# EAGLE schematic ldd-boardv42 (EAGLE 8.2.1)
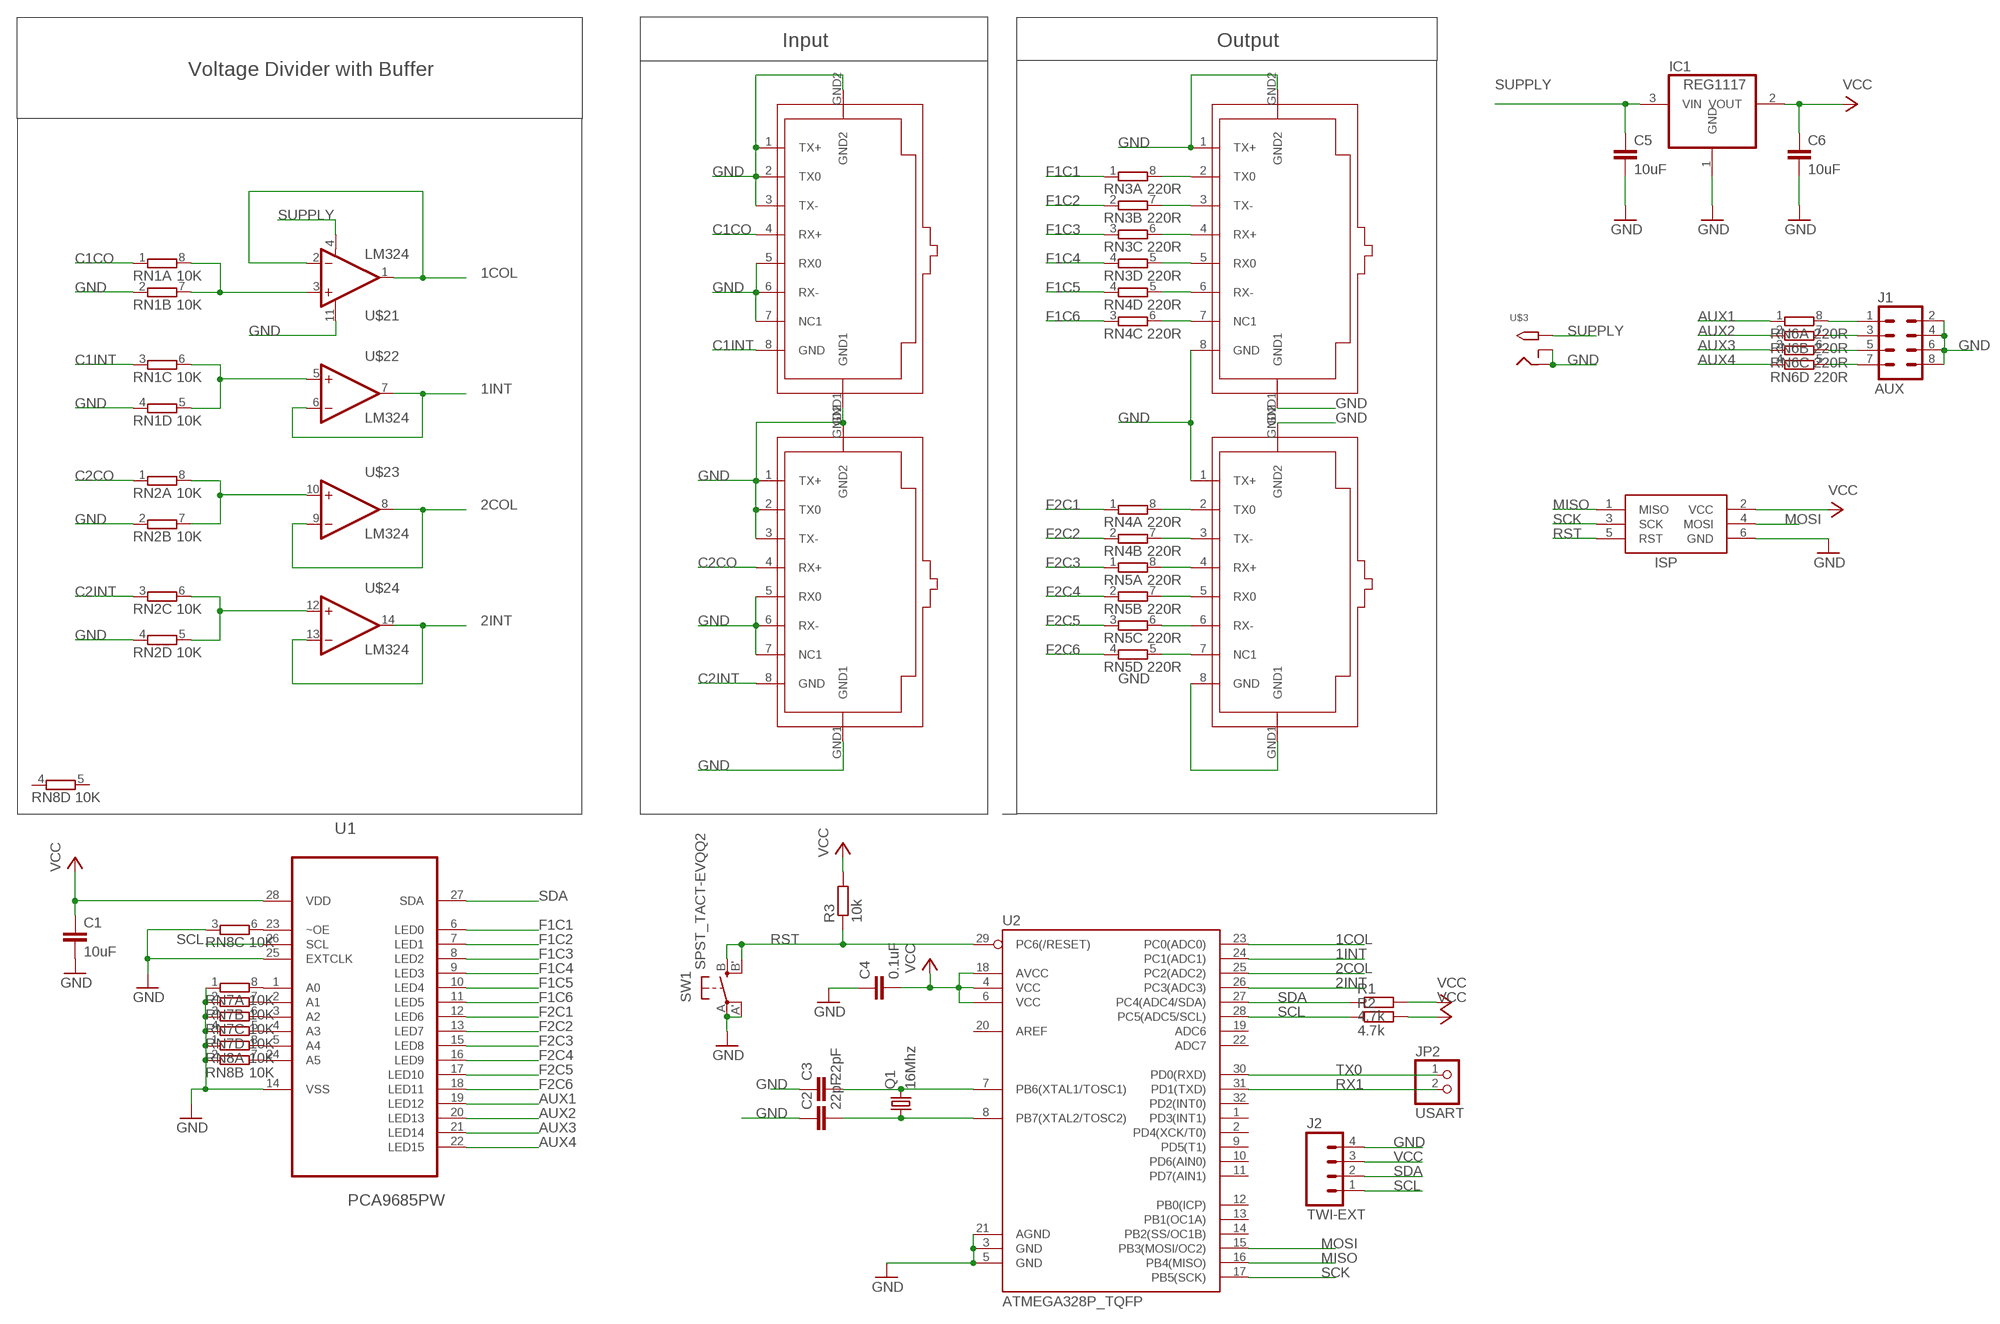
[diagram p0: schematic, sheet 1]

## Parts
C1  10uF  C-EUC0805K  [C0805K]
C2  22pF  C-EUC0805K  [C0805K]
C3  22pF  C-EUC0805K  [C0805K]
C4  0.1uF  C-EUC0805K  [C0805K]
C5  10uF  C-EUC0805K  [C0805K]
C6  10uF  C-EUC0805K  [C0805K]
IC1  REG1117  [SOT223]
ISP  AVRISP-6  [AVRISP]
J1  AUX  M04X2  [2X4]
J2  TWI-EXT  M04PTH  [1X04]
JP2  USART  PINHD-1X2  [1X02]
Q1  16Mhz  CRYSTALHC49UP  [HC49UP]
R1  4.7k  R-EU_R0805  [R0805]
R2  4.7k  R-EU_R0805  [R0805]
R3  10k  R-EU_R0805  [R0805]
RN1  10K  4R-NEXBV8V  [EXBV8V]
RN2  10K  4R-NEXBV8V  [EXBV8V]
RN3  220R  4R-NEXBV8V  [EXBV8V]
RN4  220R  4R-NEXBV8V  [EXBV8V]
RN5  220R  4R-NEXBV8V  [EXBV8V]
RN6  220R  4R-NEXBV8V  [EXBV8V]
RN7  10K  4R-NEXB38V  [EXB38V]
RN8  10K  4R-NEXB38V  [EXB38V]
SW1  SPST_TACT-EVQQ2  [EVQ-Q2]
U1  PCA9685PW  [SOP65P640X110-28N]
U2  ATMEGA328P_TQFP  [TQFP32-08]
U$1  RJ45-TRAFO  [RJ45-TRAFO]
U$2  LM324  [SOIC-14]
U$3  2.1MMJACKTHM  [PJ-102A]
U$4  RJ45-TRAFO  [RJ45-TRAFO]
U$5  RJ45-TRAFO  [RJ45-TRAFO]
U$6  RJ45-TRAFO  [RJ45-TRAFO]

## Nets
1COL: U2.23(PC0(ADC0)) U$2.1(1:OUT) U$2.2(1:-IN)
1INT: U2.24(PC1(ADC1)) U$2.6(2:-IN) U$2.7(2:OUT)
2COL: U2.25(PC2(ADC2)) U$2.8(3:OUT) U$2.9(3:-IN)
2INT: U2.26(PC3(ADC3)) U$2.13(4:-IN) U$2.14(4:OUT)
AUX1: RN6.1 U1.19(LED12)
AUX2: RN6.2 U1.20(LED13)
AUX3: RN6.3 U1.21(LED14)
AUX4: RN6.4 U1.22(LED15)
C1CO: RN1.1 U$6.4(RX+)
C1INT: RN1.3 U$6.8(GND)
C2CO: RN2.1 U$5.4(RX+)
C2INT: RN2.3 U$5.8(GND)
F1C1: RN3.1 U1.6(LED0)
F1C2: RN3.2 U1.7(LED1)
F1C3: RN3.3 U1.8(LED2)
F1C4: RN3.4 U1.9(LED3)
F1C5: RN4.4 U1.10(LED4)
F1C6: RN4.3 U1.11(LED5)
F2C1: RN4.1 U1.12(LED6)
F2C2: RN4.2 U1.13(LED7)
F2C3: RN5.1 U1.15(LED8)
F2C4: RN5.2 U1.16(LED9)
F2C5: RN5.3 U1.17(LED10)
F2C6: RN5.4 U1.18(LED11)
GND [Supply]: C1.2 C2.1 C3.1 C4.1 C5.2 C6.2 IC1.1(GND) ISP.6(GND) J1.2 J1.4 J1.6 J1.8 J2.4 RN1.2 RN1.4 RN2.2 RN2.4 RN7.1 RN7.2 RN7.3 RN7.4 RN8.1 RN8.2 RN8.3 SW1.A'(P1) SW1.A(P) U1.14(VSS) U1.25(EXTCLK) U2.3(GND) U2.5(GND) U2.21(AGND) U$1.1(TX+) U$1.8(GND) U$1.GND1 U$1.GND2 U$2.11(1:V-) U$3.RING U$3.RING_SW U$4.1(TX+) U$4.8(GND) U$4.GND1 U$4.GND2 U$5.1(TX+) U$5.2(TX0) U$5.3(TX-) U$5.5(RX0) U$5.6(RX-) U$5.7(NC1) U$5.GND1 U$5.GND2 U$6.1(TX+) U$6.2(TX0) U$6.3(TX-) U$6.5(RX0) U$6.6(RX-) U$6.7(NC1) U$6.GND1 U$6.GND2
MISO: ISP.1(MISO) U2.16(PB4(MISO))
MOSI: ISP.4(MOSI) U2.15(PB3(MOSI/OC2))
N$1: RN1.7 RN1.8 U$2.3(1:+IN)
N$2: RN1.5 RN1.6 U$2.5(2:+IN)
N$3: J1.1 RN6.8
N$4: RN4.6 U$4.7(NC1)
N$5: RN2.7 RN2.8 U$2.10(3:+IN)
N$6: RN4.5 U$4.6(RX-)
N$7: RN3.5 U$4.5(RX0)
N$8: RN2.5 RN2.6 U$2.12(4:+IN)
N$9: RN3.6 U$4.4(RX+)
N$10: RN3.7 U$4.3(TX-)
N$11: RN3.8 U$4.2(TX0)
N$12: J1.3 RN6.7
N$13: J1.5 RN6.6
N$14: J1.7 RN6.5
N$15: RN7.8 U1.1(A0)
N$16: RN7.7 U1.2(A1)
N$17: RN7.6 U1.3(A2)
N$18: RN7.5 U1.4(A3)
N$19: RN8.8 U1.5(A4)
N$20: RN4.7 U$1.3(TX-)
N$21: RN4.8 U$1.2(TX0)
N$22: RN5.8 U$1.4(RX+)
N$23: RN5.7 U$1.5(RX0)
N$24: RN5.6 U$1.6(RX-)
N$25: RN5.5 U$1.7(NC1)
N$26: RN8.7 U1.24(A5)
N$27: C3.2 Q1.2 U2.7(PB6(XTAL1/TOSC1))
N$28: RN8.6 U1.23(~OE)
N$29: C2.2 Q1.1 U2.8(PB7(XTAL2/TOSC2))
RST: ISP.5(RST) R3.1 SW1.B'(S1) SW1.B(S) U2.29(PC6(/RESET))
RX1: JP2.2 U2.31(PD1(TXD))
SCK: ISP.3(SCK) U2.17(PB5(SCK))
SCL: J2.1 R2.1 U1.26(SCL) U2.28(PC5(ADC5/SCL))
SDA: J2.2 R1.1 U1.27(SDA) U2.27(PC4(ADC4/SDA))
SUPPLY [Supply]: C5.1 IC1.3(VIN) U$2.4(1:V+) U$3.TIP
TX0: JP2.1 U2.30(PD0(RXD))
VCC: C1.1 C4.2 C6.1 IC1.2(VOUT) ISP.2(VCC) J2.3 R1.2 R2.2 R3.2 U1.28(VDD) U2.4(VCC) U2.6(VCC) U2.18(AVCC)
Unconnected: RN8.4 RN8.5 U2.1(PD3(INT1)) U2.2(PD4(XCK/T0)) U2.9(PD5(T1)) U2.10(PD6(AIN0)) U2.11(PD7(AIN1)) U2.12(PB0(ICP)) U2.13(PB1(OC1A)) U2.14(PB2(SS/OC1B)) U2.19(ADC6) U2.20(AREF) U2.22(ADC7) U2.32(PD2(INT0))

## Notes on the sheet
- Input | Output
- Voltage Divider with Buffer

## Library data of the parts
C1 C5 C6 = rcl:C-EU: CAPACITOR, European symbol; MPN: GRT21BR61E106KE13L; OC_NEWARK: 01AC8983
C2 C3 = rcl:C-EU: CAPACITOR, European symbol; MPN: 04025A220JAT2A; OC_NEWARK: 96M1143
C4 = rcl:C-EU: CAPACITOR, European symbol; MPN: 0603YC104K4Z2A; OC_NEWARK: 26M5119
IC1 = burr-brown:REG1117: 800mA and 1A Low Dropout (LDO) Positive Regulator 1.8V, 2.5V, 2.85V, 3.3V, 5V, and Adj; MPN: REG1117; OC_FARNELL: 1097566; OC_NEWARK: 14P6981
ISP = adafruit:AVRISP: AVR ISP HEADER Standard 6 pin header for AVR programming; OC_NEWARK: unknown
J1 = SparkFun-Connectors:M04X2: .1" header, two rows of four.; OC_NEWARK: unknown
J2 = SparkFun-Connectors:M04: Header 4 Standard 4-pin 0.1" header. Use with straight break away headers (SKU : PRT-00116), right angle break away headers (PRT-00553), swiss pins (PRT-00743), machine pins (PRT-00117), and female headers (PRT-00115). Molex polarized connector foot print use with SKU : PRT-08231 with associated crimp pins and housings. 1MM SMD Version SKU: PRT-10208; OC_NEWARK: unknown; PROD_ID: CONN-09696
JP2 = pinhead:PINHD-1X2: PIN HEADER; OC_NEWARK: unknown
Q1 = adafruit:CRYSTAL: CRYSTAL; OC_FARNELL: unknown; OC_NEWARK: unknown
R1 R2 = rcl:R-EU_: RESISTOR, European symbol; MF: VISHAY/DALE; MPN: CRCW08054K70JNEA; OC_NEWARK: 01H7096
R3 = rcl:R-EU_: RESISTOR, European symbol; MPN: TNPW080510K0DEEA; OC_NEWARK: 05R1479
RN1-RN8 = resistor-dil:4R-N: Array Chip Resistor Source: RS Component / Phycomp; OC_FARNELL: unknown; OC_NEWARK: unknown
SW1 = adafruit:SPST_TACT: SMT 6mm switch, EVQQ2 series http://www.ladyada.net/library/eagle; OC_NEWARK: unknown
U1 = NXP_By_element14_Batch_1:PCA9685PW: 16-channel, 12-bit PWM Fm+ I2C-bus LED controller; MPN: PCA9685PW; OC_FARNELL: 1854074; OC_NEWARK: 19T6398; PACKAGE: TSSOP-28; SUPPLIER: NXP
U2 = SparkFun-IC-Microcontroller:ATMEGA328P_TQFP: Popular 328P in QFP Storefront component: ATmega328 - TQFP <https://www.sparkfun.com/products/13448> (COM-13448) Datasheet <http://www.sparkfun.com/datasheets/Components/SMD/ATMega328.pdf> SparkFun Products SparkFun RedBoard - Programmed with Arduino <https://www.sparkfun.com/products/12757> (DEV-12757) Arduino Pro Mini 328 - 5V/16MHz <https://www.sparkfun.com/products/11113> (DEV-11113) Arduino Pro Mini 328 - 3.3V/8MHz <https://www.sparkfun.com/products/11114> (DEV-11114) SparkFun OpenLog <https://www.sparkfun.com/products/13712> (DEV-13712) SparkFun MicroView - OLED Arduino Module <https://www.sparkfun.com/products/12923> (DEV-12923) SparkFun Digital Sandbox <https://www.sparkfun.com/products/12651> (DEV-12651) SparkFun PicoBoard <https://www.sparkfun.com/products/11888> (WIG-11888) Arduino Fio <https://www.sparkfun.com/products/10116> (DEV-10116) LilyPad Arduino 328 Main Board <https://www.sparkfun.com/products/13342> (DEV-13342) SparkFun RedStick <https://www.sparkfun.com/products/13741> (DEV-13741) LilyPad MP3 <https://www.sparkfun.com/products/11013> (DEV-11013) LilyPad Arduino SimpleSnap <https://www.sparkfun.com/products/10941> (DEV-10941) SparkFun Stepoko <https://www.sparkfun.com/products/13899> (ROB-13899) SparkFun Geiger Counter <https://www.sparkfun.com/products/11345> (SEN-11345) SparkFun EL Sequencer <https://www.sparkfun.com/products/12781> (COM-12781) Arduino Pro 328 - 5V/16MHz <https://www.sparkfun.com/products/10915> (DEV-10915) CryptoCape <https://www.sparkfun.com/products/12773> (DEV-12773) SparkFun IR Thermometer Evaluation Board - MLX90614 <https://www.sparkfun.com/products/10740> (SEN-10740) SparkFun RedBot Mainboard <https://www.sparkfun.com/products/12097> (ROB-12097) Arduino Pro 328 - 3.3V/8MHz <https://www.sparkfun.com/products/10914> (DEV-10914) SparkFun Block for Intel® Edison - Arduino <https://www.sparkfun.com/products/13036> (DEV-13036) SparkFun Simon Says - Surface Mount Soldering Kit <https://www.sparkfun.com/products/10935> (KIT-10935) SparkFun 7-Segment Serial Display - Red <https://www.sparkfun.com/products/11441> (COM-11441) SparkFun 7-Segment Serial Display - White <https://www.sparkfun.com/products/11629> (COM-11629) SparkFun 7-Segment Serial Display - Yellow <https://www.sparkfun.com/products/11443> (COM-11443) SparkFun 7-Segment Serial Display - Kelly Green <https://www.sparkfun.com/products/11440> (COM-11440) SparkFun 7-Segment Serial Display - Blue <https://www.sparkfun.com/products/11442> (COM-11442) SparkFun OpenSegment Serial Display - 20mm (Blue) <https://www.sparkfun.com/products/11647> (COM-11647) SparkFun OpenSegment Serial Display - 20mm (Green) <https://www.sparkfun.com/products/11646> (COM-11646) SparkFun OpenSegment Serial Display - 20mm (White) <https://www.sparkfun.com/products/11648> (COM-11648) SparkFun OpenSegment Serial Display - 20mm (Red) <https://www.sparkfun.com/products/11644> (COM-11644) SparkFun OpenSegment Serial Display - 20mm (Yellow) <https://www.sparkfun.com/products/11645> (COM-11645) SparkFun OpenSegment Shield <https://www.sparkfun.com/products/13190> (DEV-13190); OC_NEWARK: unknown; PROD_ID: IC-09069
U$1 U$4-U$6 = con-amphenol-rj45-ld:RJ45-TRAFO: RJ45 socket with integrated magnetics Naming: Amphenol LMJ1598824110DT39 TME RJ45-TRAFO Author: Petr Kalandra <mailto:kalandrap@gmail.com> Datasheet: http://zefiryn.tme.pl/dok/zlacza/rjtrafo.pdf; OC_NEWARK: unknown
U$2 = seanvoisen:LM324: LM324 Quad Op-amp; OC_NEWARK: unknown
U$3 = adafruit:2.1MMJACK: 2.1mm x 5.5mm THM DC jack with internal switch. Digikey part #PJ-102A, 4UCON part #05537 2.1mm x 5.5mm SMT DC jack with internal switch. Digikey part #PJ-002A-SMT, 4UCON part #03267 By microbuilder.eu & adafruit.com; OC_NEWARK: unknown

## Net classes
0 default: width 0.305 mm
1 Supply: width 0.457 mm